# Altium schematic sheet [4]-Analog Input.SchDoc
size A3; DocumentNumber: 4; SheetNumber: 4; SheetTotal: 5
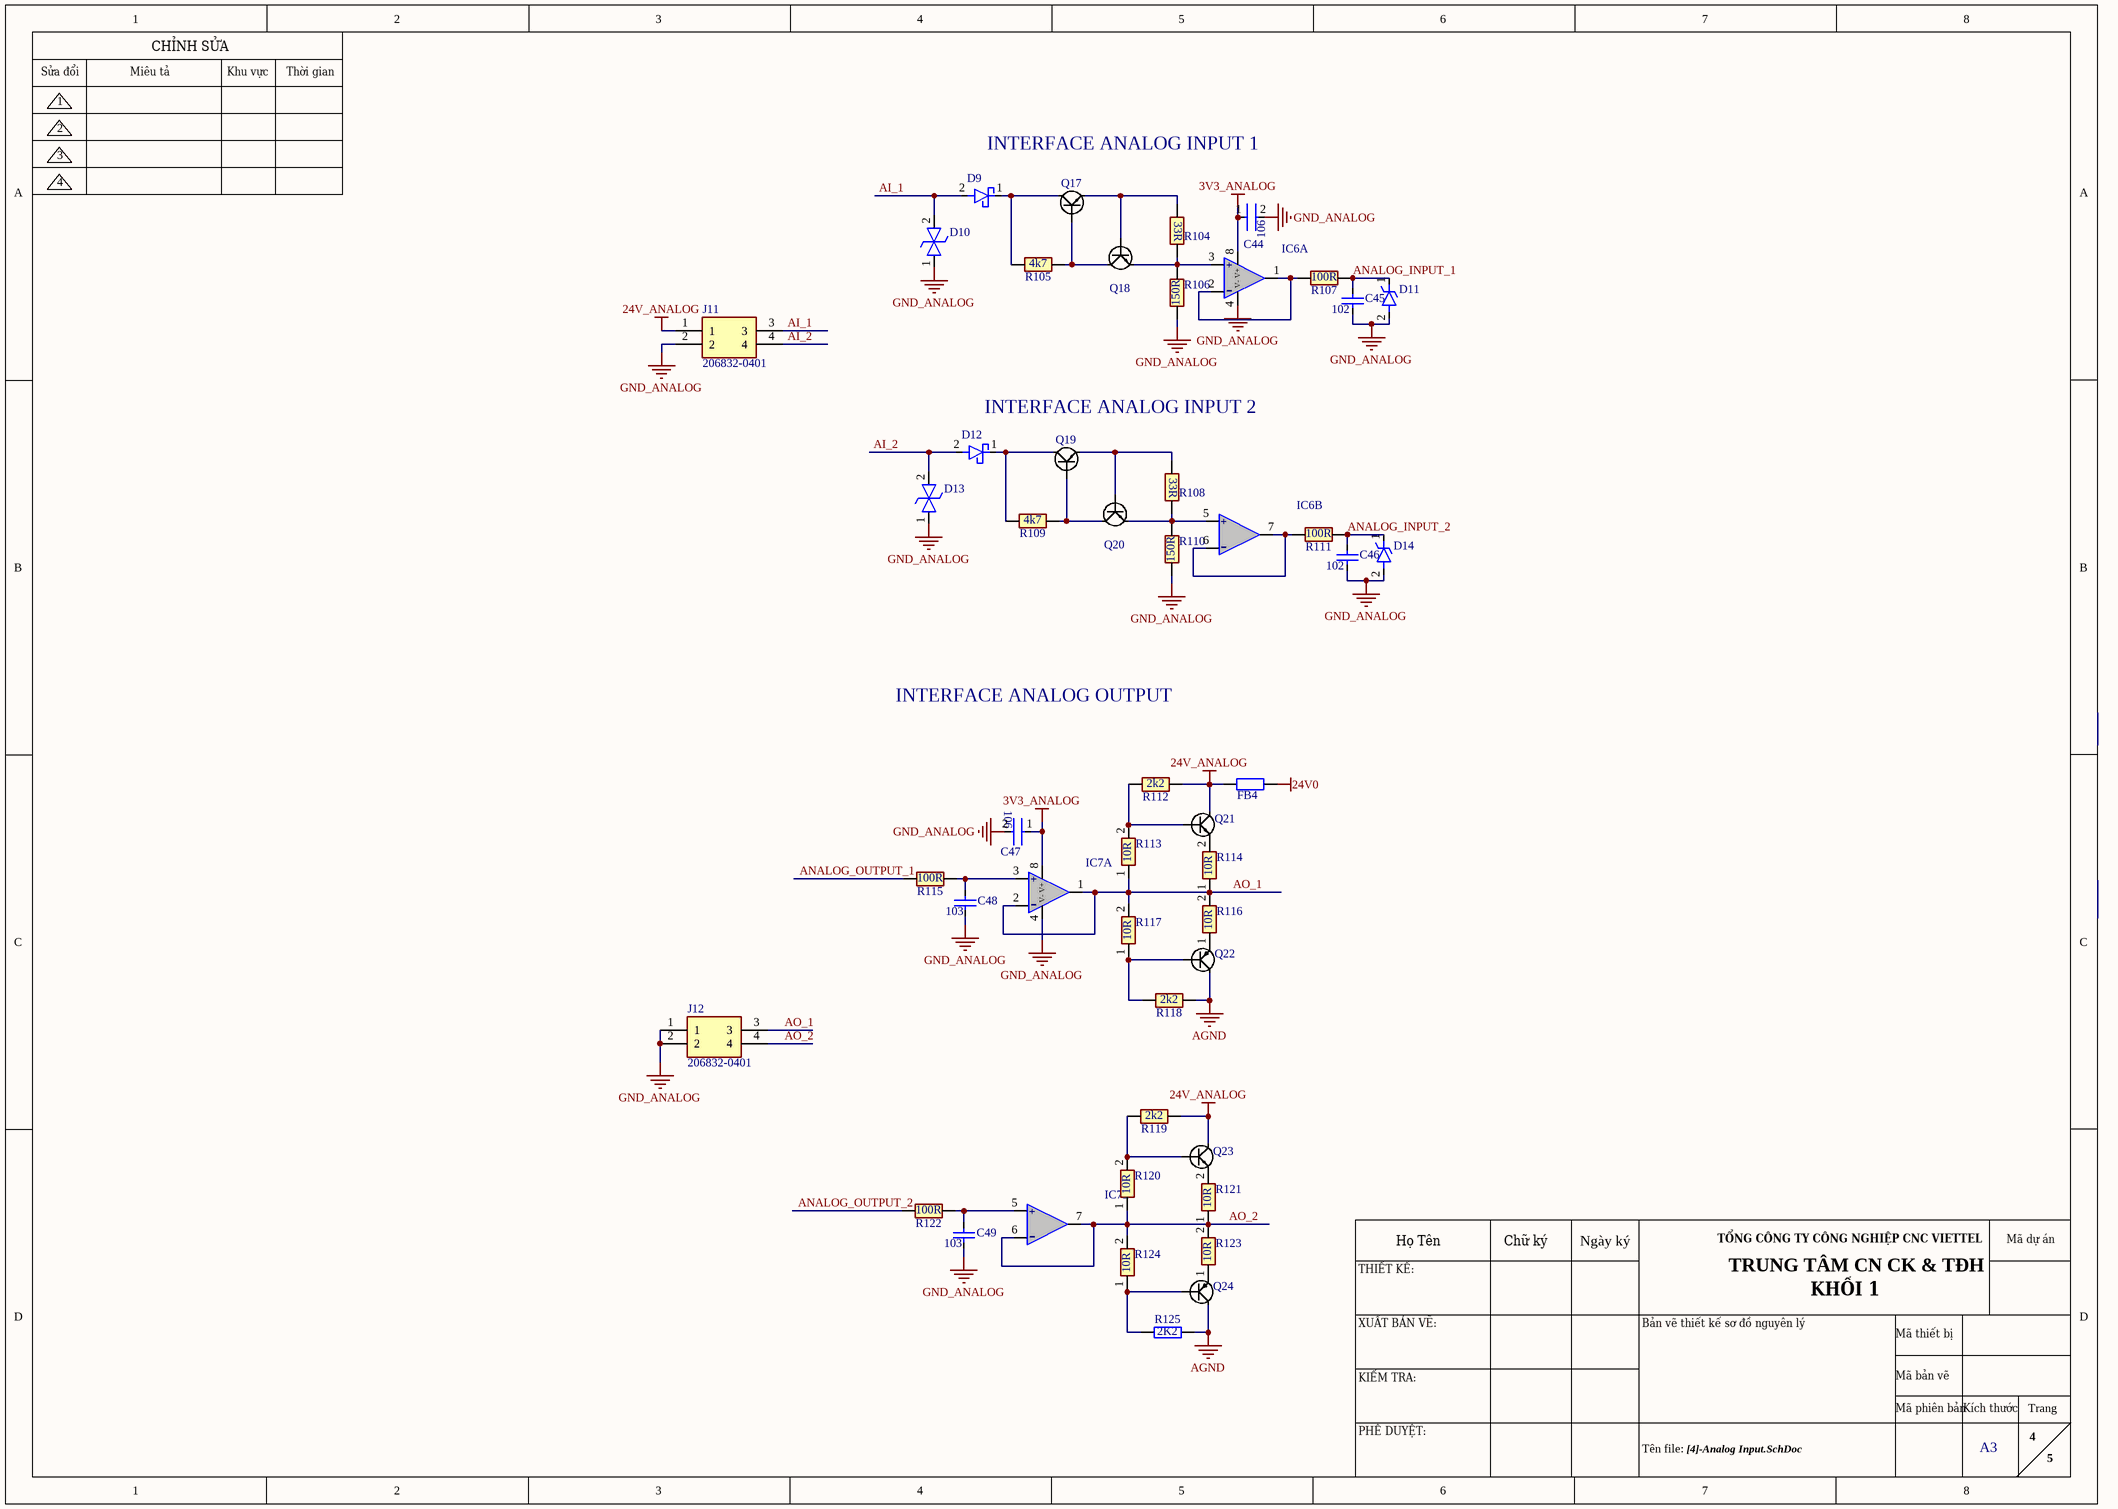
[diagram p0: [4]-Analog Input.SchDoc]

## Parts
C44  C0603_106_35V  [C0603]  (value not drawn)
C45  C0603_102_50V  [C0603]  (value not drawn)
C46  C0603_102_50V  [C0603]  (value not drawn)
C47  C0603_106_35V  [C0603]  (value not drawn)
C48  C0603_103_50V  [C0603]  (value not drawn)
C49  C0603_103_50V  [C0603]  (value not drawn)
D9  SS36FA  [SOD-123FA-2]  (value not drawn)
D10  SMCJ36CA_V6G  [DIONM7959X262N]  (value not drawn)
D11  MM3Z3V3B  [SOD323F]  (value not drawn)
D12  SS36FA  [SOD-123FA-2]  (value not drawn)
D13  SMCJ36CA_V6G  [DIONM7959X262N]  (value not drawn)
D14  MM3Z3V3B  [SOD323F]  (value not drawn)
FB4  FERRIT_0805_1A  [FB0805]  (value not drawn)
IC6  LM358DGKR  [VSSOP-8]  (value not drawn)  (parts A,B of 2)
IC7  LM358DGKR  [VSSOP-8]  (value not drawn)  (parts A,B of 2)
J11  206832-0401  [2068320401]
J12  206832-0401  [2068320401]
Q17  MMBT3904-TP  [SOT-23-3]  (value not drawn)
Q18  MMBT3904-TP  [SOT-23-3]  (value not drawn)
Q19  MMBT3904-TP  [SOT-23-3]  (value not drawn)
Q20  MMBT3904-TP  [SOT-23-3]  (value not drawn)
Q21  PMBT2222A,215  [SOT-23]  (value not drawn)
Q22  PMBT2907A,215  [SOT-23]  (value not drawn)
Q23  PMBT2222A,215  [SOT-23]  (value not drawn)
Q24  PMBT2907A,215  [SOT-23]  (value not drawn)
R104  R0603_33R  [RES-SMD-0603]  (value not drawn)
R105  R0603_4k7  [RES-SMD-0603]  (value not drawn)
R106  R0603_150R  [RES-SMD-0603]  (value not drawn)
R107  100R  [RES-SMD-0603]  (value not drawn)
R108  R0603_33R  [RES-SMD-0603]  (value not drawn)
R109  R0603_4k7  [RES-SMD-0603]  (value not drawn)
R110  R0603_150R  [RES-SMD-0603]  (value not drawn)
R111  100R  [RES-SMD-0603]  (value not drawn)
R112  R0603_2k2  [RES-SMD-0603]  (value not drawn)
R113  R0603_10R  [RES-SMD-0603]  (value not drawn)
R114  R0603_10R  [RES-SMD-0603]  (value not drawn)
R115  100R  [RES-SMD-0603]  (value not drawn)
R116  R0603_10R  [RES-SMD-0603]  (value not drawn)
R117  R0603_10R  [RES-SMD-0603]  (value not drawn)
R118  R0603_2k2  [RES-SMD-0603]  (value not drawn)
R119  R0603_2k2  [RES-SMD-0603]  (value not drawn)
R120  R0603_10R  [RES-SMD-0603]  (value not drawn)
R121  R0603_10R  [RES-SMD-0603]  (value not drawn)
R122  100R  [RES-SMD-0603]  (value not drawn)
R123  R0603_10R  [RES-SMD-0603]  (value not drawn)
R124  R0603_10R  [RES-SMD-0603]  (value not drawn)
R125  value 2K2  [R0603]

## Nets
3V3_ANALOG: C44.1 C47.1 IC6.8(V+) IC7.8(V+)
24V0: FB4.2
24V_ANALOG: FB4.1 J11.1 Q21.3(C) Q23.3(C) R112.2 R119.2
AGND: Q22.3(C) Q24.3(C) R118.2 R125.2
GND_ANALOG: C44.2 C45.2 C46.2 C47.2 C48.2 C49.2 D11.2(A) D14.2(A) IC6.4(V-) IC7.4(V-) J11.2 J12.1 J12.2 R106.1 R110.1
AI_1: D9.2(A) D10.2 J11.3
AI_2: D12.2(A) D13.2 J11.4
ANALOG_INPUT_1: C45.1 D11.1(K) R107.2
ANALOG_INPUT_2: C46.1 D14.1(K) R111.2
ANALOG_OUTPUT_1: R115.1
ANALOG_OUTPUT_2: R122.1
AO_1: IC7.1 IC7.2 J12.3 R113.1 R114.1 R116.2 R117.2
AO_2: IC7.6 IC7.7 J12.4 R120.1 R121.1 R123.2 R124.2
NetC48_1: C48.1 IC7.3 R115.2
NetC49_1: C49.1 IC7.5 R122.2
NetD9_1: D9.1(K) Q17.3(C) R105.1
NetD12_1: D12.1(K) Q19.3(C) R109.1
NetIC6_1: IC6.1 IC6.2 R107.1
NetIC6_3: IC6.3 Q18.2(E) R104.2 R106.2
NetIC6_5: IC6.5 Q20.2(E) R108.2 R110.2
NetIC6_6: IC6.6 IC6.7 R111.1
NetQ17_1: Q17.1(B) Q18.3(C) R105.2
NetQ17_2: Q17.2(E) Q18.1(B) R104.1
NetQ19_1: Q19.1(B) Q20.3(C) R109.2
NetQ19_2: Q19.2(E) Q20.1(B) R108.1
NetQ21_1: Q21.1(B) R112.1 R113.2
NetQ21_2: Q21.2(E) R114.2
NetQ22_1: Q22.1(B) R117.1 R118.1
NetQ22_2: Q22.2(E) R116.1
NetQ23_1: Q23.1(B) R119.1 R120.2
NetQ23_2: Q23.2(E) R121.2
NetQ24_1: Q24.1(B) R124.1 R125.1
NetQ24_2: Q24.2(E) R123.1

Not connected (* = marked no-connect by the designer): D10 1; D13 1

## Notes on the sheet
- INTERFACE ANALOG INPUT 1
- INTERFACE ANALOG INPUT 2
- INTERFACE ANALOG OUTPUT
- Labels drawn without touching a wire or pin: GND_ANALOG
- Sửa đổi
- 1
- Miêu tả
- CHỈNH SỬA
- Khu vực
- Thời gian
- 2
- 3
- 4
- Họ Tên
- Chữ ký
- Ngày ký
- TỔNG CÔNG TY CÔNG NGHIỆP CNC VIETTEL
- Mã dự án
- THIẾT KẾ:
- XUẤT BẢN VẼ:
- Bản vẽ thiết kế sơ đồ nguyên lý
- TRUNG TÂM CN CK & TĐH
- KHỐI 1
- KIỂM TRA:
- Mã thiết bị
- Mã bản vẽ
- PHÊ DUYỆT:
- Tên file:
- Mã phiên bản
- Kích thước
- A3
- Trang
- (in symbol C0603_102_50V) 102
- (in symbol C0603_103_50V) 103
- (in symbol C0603_106_35V) 106
- (in symbol LM358DGKR, part A) +; -
- (in symbol LM358DGKR, part B) +; -
- (in symbol R0603_2k2) 2k2
- (in symbol R0603_4k7) 4k7
- (in symbol R0603_10R) 10R
- (in symbol R0603_33R) 33R
- (in symbol R0603_150R) 150R

## Library data of the parts
C44 C47 = C0603_106_35V: Multilayer Ceramic Capacitors MLCC - SMD/SMT 10 uF 35 VDC 20% 0603 X5R; Manufacturer_Name: Murata Electronics; Manufacturer_Part_Number: GRM188R6YA106MA73J; Datasheet Link: http://componentsearchengine.com/Datasheets/1/GRM188R6YA106MA73J.pdf; Height: 0.9mm; Mouser Part Number: 81-GRM188R6YA106MA3J; Mouser Price/Stock: https://www.mouser.co.uk/ProductDetail/Murata-Electronics/GRM188R6YA106MA73J?qs=5aG0NVq1C4xLSwNPdfnaYg%3D%3D; Arrow Part Number: GRM188R6YA106MA73J; Arrow Price/Stock: https://www.arrow.com/en/products/grm188r6ya106ma73j/murata-manufacturing?region=europe
C45 C46 = C0603_102_50V: Multilayer Ceramic Capacitors MLCC - SMD/SMT 50V 1000pF X7R 0603 10%; Manufacturer_Name: YAGEO; Manufacturer_Part_Number: CC0603KRX7R9BB102; Datasheet Link: https://www.yageo.com/upload/media/product/productsearch/datasheet/mlcc/UPY-GPHC_X7R_6.3V-to-50V_20.pdf; Height: 0.9mm; Mouser Part Number: 603-CC603KRX7R9BB102; Mouser Price/Stock: https://www.mouser.co.uk/ProductDetail/YAGEO/CC0603KRX7R9BB102?qs=AgBp2OyFlx%2F%2Fw3f5uZqSVQ%3D%3D; Arrow Part Number: CC0603KRX7R9BB102; Arrow Price/Stock: https://www.arrow.com/en/products/cc0603krx7r9bb102/yageo?region=nac
C48 C49 = C0603_103_50V: Multilayer Ceramic Capacitors MLCC - SMD/SMT 50V 0.01uF X7R 0603 10%; Manufacturer_Name: KEMET; Manufacturer_Part_Number: CC0603KRX7R9BB103; Datasheet Link: https://datasheet.datasheetarchive.com/originals/distributors/Datasheets_SAMA/d9f127a4875522309d99aa7dec79633c.pdf; Height: 0.9mm; Mouser Part Number: 603-CC603KRX7R9BB103; Mouser Price/Stock: https://www.mouser.co.uk/ProductDetail/YAGEO/CC0603KRX7R9BB103?qs=AgBp2OyFlx%252BeoRRspw6PJg%3D%3D; Arrow Part Number: CC0603KRX7R9BB103; Arrow Price/Stock: https://www.arrow.com/en/products/cc0603krx7r9bb103/yageo?region=nac
D9 D12 = SS36FA: Schottky Diodes & Rectifiers 60V 3A Schottky B arrier Rectifier; Manufacturer_Name: onsemi; Datasheet Link: http://www.mouser.com/ds/2/149/SS36FA-1012713.pdf; Height: 1.43mm; Manufacturer_Part_Number: SS36FA; Mouser Part Number: 512-SS36FA; Mouser Price/Stock: https://www.mouser.co.uk/ProductDetail/onsemi-Fairchild/SS36FA?qs=R26iFe%2FkX%2FItXtD88dS%252Bdg%3D%3D; Arrow Part Number: SS36FA; Arrow Price/Stock: https://www.arrow.com/en/products/ss36fa/on-semiconductor?region=nac
D10 D13 = SMCJ36CA_V6G: TVS Diode (Bi-directional); Manufacturer_Name: Taiwan Semiconductor; Manufacturer_Part_Number: SMCJ36CA V6G; Datasheet Link: https://nl.mouser.com/datasheet/2/395/SMCJ_SERIES_Q1812-1621658.pdf; Height: 2.62mm; Mouser Part Number: 821-SMCJ36CAV6G; Mouser Price/Stock: https://www.mouser.co.uk/ProductDetail/Taiwan-Semiconductor/SMCJ36CA-V6G?qs=mAH9sUMRCtugnU9mvAo%2FtQ%3D%3D
D11 D14 = MM3Z3V3B: Zener Diodes 3.3V 200mW 2%; Manufacturer_Name: onsemi; Datasheet Link: https://componentsearchengine.com/Datasheets/2/MM3Z3V3B.pdf; Height: 1mm; Manufacturer_Part_Number: MM3Z3V3B; Mouser Part Number: 512-MM3Z3V3B; Mouser Price/Stock: https://www.mouser.co.uk/ProductDetail/onsemi-Fairchild/MM3Z3V3B?qs=rXqtSHp76q5f4A6a39tObw%3D%3D; Arrow Part Number: MM3Z3V3B; Arrow Price/Stock: https://www.arrow.com/en/products/mm3z3v3b/on-semiconductor?region=nac
FB4 = FERRIT_0805_1A: Manufacturer: Laird-Signal Integrity Products; Part Number: MI0805J102R-10; info: FERRITE BEAD 1 KOHM 0805 1LN; Temperature: -40°C ~ 125°C; URL: https://www.digikey.com/en/products/detail/laird-signal-integrity-products/MI0805J102R-10/1015975; Price: 0.2; Manufacturer Part Number: MI0805J102R-10
IC6 IC7 = LM358DGKR: Integrated Circuit; Manufacturer_Name: Texas Instruments; Datasheet Link: http://www.ti.com/lit/gpn/lm358; Height: 1.1mm; Manufacturer_Part_Number: LM358DGKR; Mouser Part Number: 595-LM358DGKR; Mouser Price/Stock: https://www.mouser.co.uk/ProductDetail/Texas-Instruments/LM358DGKR?qs=VBduBm9rCJQpfL21a%2FCtGg%3D%3D; Arrow Part Number: LM358DGKR; Arrow Price/Stock: https://www.arrow.com/en/products/lm358dgkr/texas-instruments?region=nac
J11 J12 = Header_2x2_male: Headers & Wire Housings Micro-Fit Plus Vert HDR ASSY 2X2 Tin Lu; Manufacturer_Name: Molex; Datasheet Link: https://componentsearchengine.com/Datasheets/2/206832-0401.pdf; Height: 10.16mm; Manufacturer_Part_Number: 206832-0401; Mouser Part Number: 538-206832-0401; Mouser Price/Stock: https://www.mouser.co.uk/ProductDetail/Molex/206832-0401?qs=EBDBlbfErPx8hhLov6Llfw%3D%3D; Arrow Part Number: 206832-0401; Arrow Price/Stock: https://www.arrow.com/en/products/2068320401/molex
Q17-Q20 = MMBT3904-TP: Transistor BJT NPN; Manufacturer_Name: MCC; Datasheet Link: https://mccsemi.com/pdf/Products/MMBT3904(SOT-23).pdf; Height: 1.25mm; Manufacturer_Part_Number: MMBT3904-TP; Mouser Part Number: 833-MMBT3904-TP; Mouser Price/Stock: https://www.mouser.co.uk/ProductDetail/Micro-Commercial-Components-MCC/MMBT3904-TP?qs=KFo7JewZbUHicjDjIayULQ%3D%3D; Arrow Part Number: MMBT3904-TP; Arrow Price/Stock: https://www.arrow.com/en/products/mmbt3904-tp/micro-commercial-components?region=nac
Q21 Q23 = PMBT2222A,215: Bipolar (BJT) Transistor NPN 30 V 600 mA 300MHz 250 mW Surface Mount TO-236AB; Manufacturer: Nexperia USA Inc.; Info: TRANS NPN 30V 0.6A TO236AB; Part Number: PMBT2222A,215; Temperature: 150°C (TJ); URL: https://www.digikey.com/en/products/detail/nexperia-usa-inc/PMBT2222A-215/763342; Price: 0.14
Q22 Q24 = PMBT2907A,215: Bipolar (BJT) Transistor PNP 60 V 600 mA 200MHz 250 mW Surface Mount TO-236AB; Manufacturer: Nexperia USA Inc.; Info: TRANS PNP 60V 0.6A TO236AB; Part Number: PMBT2907A,215; Temperature: 150°C (TJ); URL: https://www.digikey.com/en/products/detail/nexperia-usa-inc/PMBT2907A-215/763344; Price: 0.14
R104 R108 = R0603_33R: Resistor; Manufacturer_Name: KEMET; Manufacturer_Part_Number: RC0603FR-0733RL; Datasheet Link: http://www.yageo.com/documents/recent/PYu-RC0603_51_RoHS_L_v5.pdf; Height: 0.55mm; Mouser Part Number: 603-RC0603FR-0733RL; Mouser Price/Stock: https://www.mouser.co.uk/ProductDetail/Yageo/RC0603FR-0733RL?qs=diQw95jMAeMotgif2GSHTQ%3D%3D; Arrow Part Number: RC0603FR-0733RL; Arrow Price/Stock: https://www.arrow.com/en/products/rc0603fr-0733rl/yageo
R105 R109 = R0603_4k7: Resistor; Manufacturer_Name: Panasonic; Manufacturer_Part_Number: ERJ-U3RD4701V; Datasheet Link: https://www.mouser.com/datasheet/2/315/RDP0000C343-1855597.pdf; Height: 0.55mm; Mouser Part Number: 667-ERJ-U3RD4701V; Mouser Price/Stock: https://www.mouser.co.uk/ProductDetail/Panasonic/ERJ-U3RD4701V?qs=TiOZkKH1s2SlNNcUWMeCTg%3D%3D
R106 R110 = R0603_150R: Resistor; Manufacturer_Name: Panasonic; Manufacturer_Part_Number: ERA-3AEB151V; Datasheet Link: https://industrial.panasonic.com/cdbs/www-data/pdf/RDM0000/AOA0000C307.pdf; Height: 0.55mm; Mouser Part Number: 667-ERA-3AEB151V; Mouser Price/Stock: https://www.mouser.co.uk/ProductDetail/Panasonic/ERA-3AEB151V?qs=1VWA5LkbEaoSuQLS51KbkQ%3D%3D; Arrow Part Number: ERA-3AEB151V; Arrow Price/Stock: https://www.arrow.com/en/products/era-3aeb151v/panasonic
R107 R111 R115 R122 = R0603_100R_75V: Thick Film Resistors - SMD 1/10watt 100ohms 5%; Manufacturer_Name: Vishay; Manufacturer_Part_Number: CRCW0603100RJNEB; Datasheet Link: http://www.vishay.com/docs/20035/dcrcwe3.pdf; Height: 0.5mm; Mouser Part Number: 71-CRCW0603100RJNEB; Mouser Price/Stock: https://www.mouser.co.uk/ProductDetail/Vishay-Dale/CRCW0603100RJNEB?qs=KP%252BPudsHLdxWOy%2FUTWm2vg%3D%3D; Arrow Part Number: CRCW0603100RJNEB; Arrow Price/Stock: https://www.arrow.com/en/products/crcw0603100rjneb/vishay
R112 R118 R119 = R0603_2k2: Resistor; Manufacturer_Name: Panasonic; Manufacturer_Part_Number: ERJ-3EKF2201V; Datasheet Link: http://industrial.panasonic.com/cdbs/www-data/pdf/RDA0000/AOA0000C86.pdf; Height: 0.55mm; Mouser Part Number: 667-ERJ-3EKF2201V; Mouser Price/Stock: https://www.mouser.co.uk/ProductDetail/Panasonic/ERJ-3EKF2201V?qs=iBwFsHVUAOcSom3i15f%252BIQ%3D%3D; Arrow Part Number: ERJ-3EKF2201V; Arrow Price/Stock: https://www.arrow.com/en/products/erj-3ekf2201v/panasonic?region=nac
R113 R114 R116 R117 R120 R121 R123 R124 = R0603_10R: Thick Film Resistors - SMD 0603 10ohm 1% Anti-Surge AEC-Q200; Manufacturer_Name: Panasonic; Manufacturer_Part_Number: ERJ-PA3F10R0V; Datasheet Link: https://industrial.panasonic.com/cdbs/www-data/pdf/RDO0000/AOA0000C331.pdf; Height: 0.55mm; Mouser Part Number: 667-ERJ-PA3F10R0V; Mouser Price/Stock: https://www.mouser.co.uk/ProductDetail/Panasonic/ERJ-PA3F10R0V?qs=BzJM0faLVqWcnhwAdyTQJQ%3D%3D; Arrow Part Number: ERJ-PA3F10R0V; Arrow Price/Stock: https://www.arrow.com/en/products/erjpa3f10r0v/panasonic?region=europe
R125 = R0603_2K2: 2.2 kOhms ±1% 0.1W, 1/10W Chip Resistor 0603 (1608 Metric) Moisture Resistant Thick Film; Manufacturer: YAGEO; Part Number: RC0603FR-132K2L; info: RES 2.2K OHM 1% 1/10W 0603; Temperature: -55°C ~ 155°C; URL: https://www.digikey.com/en/products/detail/yageo/RC0603FR-132K2L/13694214; Price: 0.1